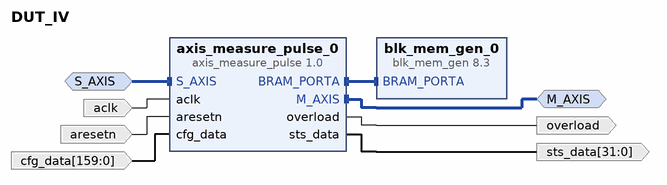
[diagram p0: block diagram of the top level]
# Vivado block design DUT_IV, Vivado 2015.4
create_bd_design DUT_IV

create_bd_intf_port -mode Slave -vlnv xilinx.com:interface:axis_rtl:1.0 S_AXIS
set_property -dict [list \
  CONFIG.TDATA_NUM_BYTES 2 \
  CONFIG.TDEST_WIDTH 0 \
  CONFIG.TID_WIDTH 0 \
  CONFIG.TUSER_WIDTH 0 \
  CONFIG.HAS_TREADY 1 \
  CONFIG.HAS_TSTRB 0 \
  CONFIG.HAS_TKEEP 0 \
  CONFIG.HAS_TLAST 0 \
  CONFIG.LAYERED_METADATA undef \
] [get_bd_intf_ports S_AXIS]
create_bd_intf_port -mode Master -vlnv xilinx.com:interface:axis_rtl:1.0 M_AXIS
create_bd_port -dir I -type clk aclk
create_bd_port -dir I -type rst aresetn
create_bd_port -dir I -from 159 -to 0 cfg_data
create_bd_port -dir O -from 31 -to 0 sts_data
create_bd_port -dir O overload

create_bd_cell -type ip -vlnv xilinx.com:ip:blk_mem_gen:8.3 blk_mem_gen_0
set_property -dict [list \
  CONFIG.Memory_Type True_Dual_Port_RAM \
  CONFIG.Enable_32bit_Address false \
  CONFIG.Use_Byte_Write_Enable false \
  CONFIG.Write_Width_A 16 \
  CONFIG.Read_Width_A 16 \
  CONFIG.Enable_A Always_Enabled \
  CONFIG.Write_Width_B 32 \
  CONFIG.Read_Width_B 32 \
  CONFIG.Enable_B Always_Enabled \
  CONFIG.Register_PortA_Output_of_Memory_Primitives true \
  CONFIG.Register_PortB_Output_of_Memory_Primitives true \
  CONFIG.Load_Init_File true \
  CONFIG.Coe_File BRAM.coe \
  CONFIG.Use_RSTA_Pin false \
  CONFIG.Port_B_Clock 100 \
  CONFIG.Port_B_Write_Rate 50 \
  CONFIG.Port_B_Enable_Rate 100 \
  CONFIG.use_bram_block Stand_Alone \
] [get_bd_cells blk_mem_gen_0]
create_bd_cell -type ip -vlnv pavel-demin:user:axis_measure_pulse:1.0 axis_measure_pulse_0
set_property -dict {CONFIG.BRAM_ADDR_WIDTH 18} [get_bd_cells axis_measure_pulse_0]

# ---- connections ----

connect_bd_intf_net [get_bd_intf_pins blk_mem_gen_0/BRAM_PORTA] [get_bd_intf_pins axis_measure_pulse_0/BRAM_PORTA]
connect_bd_intf_net [get_bd_intf_ports S_AXIS] [get_bd_intf_pins axis_measure_pulse_0/S_AXIS]
connect_bd_intf_net [get_bd_intf_ports M_AXIS] [get_bd_intf_pins axis_measure_pulse_0/M_AXIS]
connect_bd_net [get_bd_ports aclk] [get_bd_pins axis_measure_pulse_0/aclk]
connect_bd_net [get_bd_ports aresetn] [get_bd_pins axis_measure_pulse_0/aresetn]
connect_bd_net [get_bd_ports cfg_data] [get_bd_pins axis_measure_pulse_0/cfg_data]
connect_bd_net [get_bd_pins axis_measure_pulse_0/sts_data] [get_bd_ports sts_data]
connect_bd_net [get_bd_pins axis_measure_pulse_0/overload] [get_bd_ports overload]

validate_bd_design
save_bd_design
